# Altium schematic sheet CPU.SchDoc
size A4
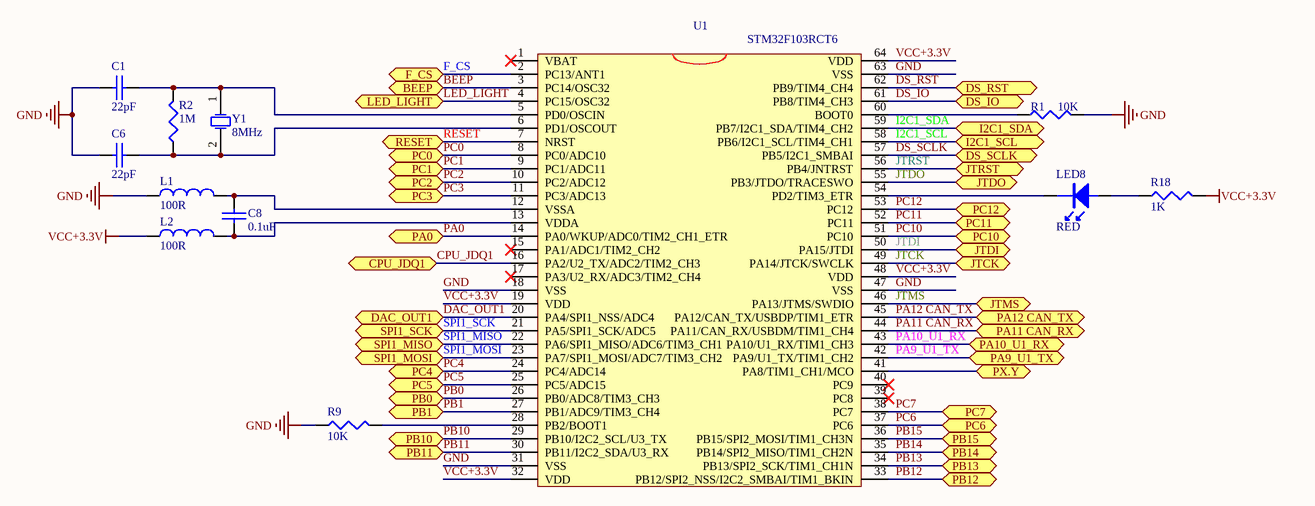
[diagram p0: CPU.SchDoc]

## Parts
C1  22pF  [0603]
C6  22pF  [0603]
C8  0.1uF  [0603]
L1  100R  [0805]
L2  100R  [0805]
LED8  RED  [LED-0603]
R1  10K  [0603]
R2  1M  [0603]
R9  10K  [0603]
R18  1K  [0603]
U1  STM32F103RCT6  [LQFP64_N]
Y1  8MHz  [XTAL_US]

## Ports
BEEP, CPU_JDQ1, DAC_OUT1, DS_IO, DS_RST, DS_SCLK, F_CS, I2C1_SCL, I2C1_SDA, JTCK, JTDI, JTDO, JTMS, JTRST, LED_LIGHT, PA0, PA9_U1_TX, PA10_U1_RX, PA11 CAN_RX, PA12 CAN_TX, PB0, PB1, PB10, PB11, PB12, PB13, PB14, PB15, PC0, PC1, PC2, PC3, PC4, PC5, PC6, PC7, PC10, PC11, PC12, PX.Y, RESET, SPI1_MISO, SPI1_MOSI, SPI1_SCK

## Nets
GND: C1.1 C6.1 L1.1 R1.2 R9.1 U1.18(VSS) U1.31(VSS) U1.47(VSS) U1.63(VSS)
VCC+3.3V: L2.1 R18.2 U1.19(VDD) U1.32(VDD) U1.48(VDD) U1.64(VDD)
BEEP: U1.3(PC14/OSC32) ; port BEEP
CPU_JDQ1: U1.16(PA2/U2_TX/ADC2/TIM2_CH3) ; port CPU_JDQ1
DAC_OUT1: U1.20(PA4/SPI1_NSS/ADC4) ; port DAC_OUT1
DS_IO: U1.61(PB8/TIM4_CH3) ; port DS_IO
DS_RST: U1.62(PB9/TIM4_CH4) ; port DS_RST
DS_SCLK: U1.57(PB5/I2C1_SMBAI) ; port DS_SCLK
F_CS: U1.2(PC13/ANT1) ; port F_CS
I2C1_SCL: U1.58(PB6/I2C1_SCL/TIM4_CH1) ; port I2C1_SCL
I2C1_SDA: U1.59(PB7/I2C1_SDA/TIM4_CH2) ; port I2C1_SDA
JTCK: U1.49(PA14/JTCK/SWCLK) ; port JTCK
JTDI: U1.50(PA15/JTDI) ; port JTDI
JTDO: U1.55(PB3/JTDO/TRACESWO) ; port JTDO
JTMS: U1.46(PA13/JTMS/SWDIO) ; port JTMS
JTRST: U1.56(PB4/JNTRST) ; port JTRST
LED_LIGHT: U1.4(PC15/OSC32) ; port LED_LIGHT
PA0: U1.14(PA0/WKUP/ADC0/TIM2_CH1_ETR) ; port PA0
PA9_U1_TX: U1.42(PA9/U1_TX/TIM1_CH2) ; port PA9_U1_TX
PA10_U1_RX: U1.43(PA10/U1_RX/TIM1_CH3) ; port PA10_U1_RX
PA11 CAN_RX: U1.44(PA11/CAN_RX/USBDM/TIM1_CH4) ; port PA11 CAN_RX
PA12 CAN_TX: U1.45(PA12/CAN_TX/USBDP/TIM1_ETR) ; port PA12 CAN_TX
PB0: U1.26(PB0/ADC8/TIM3_CH3) ; port PB0
PB1: U1.27(PB1/ADC9/TIM3_CH4) ; port PB1
PB10: U1.29(PB10/I2C2_SCL/U3_TX) ; port PB10
PB11: U1.30(PB11/I2C2_SDA/U3_RX) ; port PB11
PB12: U1.33(PB12/SPI2_NSS/I2C2_SMBAI/TIM1_BKIN) ; port PB12
PB13: U1.34(PB13/SPI2_SCK/TIM1_CH1N) ; port PB13
PB14: U1.35(PB14/SPI2_MISO/TIM1_CH2N) ; port PB14
PB15: U1.36(PB15/SPI2_MOSI/TIM1_CH3N) ; port PB15
PC0: U1.8(PC0/ADC10) ; port PC0
PC1: U1.9(PC1/ADC11) ; port PC1
PC2: U1.10(PC2/ADC12) ; port PC2
PC3: U1.11(PC3/ADC13) ; port PC3
PC4: U1.24(PC4/ADC14) ; port PC4
PC5: U1.25(PC5/ADC15) ; port PC5
PC6: U1.37(PC6) ; port PC6
PC7: U1.38(PC7) ; port PC7
PC10: U1.51(PC10) ; port PC10
PC11: U1.52(PC11) ; port PC11
PC12: U1.53(PC12) ; port PC12
PX.Y: U1.41(PA8/TIM1_CH1/MCO) ; port PX.Y
RESET: U1.7(NRST) ; port RESET
SPI1_MISO: U1.22(PA6/SPI1_MISO/ADC6/TIM3_CH1) ; port SPI1_MISO
SPI1_MOSI: U1.23(PA7/SPI1_MOSI/ADC7/TIM3_CH2) ; port SPI1_MOSI
SPI1_SCK: U1.21(PA5/SPI1_SCK/ADC5) ; port SPI1_SCK
NetC1_2: C1.2 R2.2 U1.5(PD0/OSCIN) Y1.1(OSC1)
NetC6_2: C6.2 R2.1 U1.6(PD1/OSCOUT) Y1.2(OSC2)
NetC8_1: C8.1 L2.2 U1.13(VDDA)
NetC8_2: C8.2 L1.2 U1.12(VSSA)
NetLED8_1: LED8.1 R18.1
NetLED8_2: LED8.2 U1.54(PD2/TIM3_ETR)
NetR1_1: R1.1 U1.60(BOOT0)
NetR9_2: R9.2 U1.28(PB2/BOOT1)

Not connected (* = marked no-connect by the designer): U1 1(VBAT)* 15(PA1/ADC1/TIM2_CH2)* 17(PA3/U2_RX/ADC3/TIM2_CH4)* 39(PC8)* 40(PC9)*

## Library data of the parts
C1 C6 C8 = CAP-0603: 0603陶瓷贴片电容
L1 L2 = INDUCTOR
LED8 = LED-0603: LED贴片发光二极管0603封装
R1 R2 R9 R18 = RES-0603: 陶瓷贴片电阻0603封装
U1 = STM32F103RBT6: STM32F103RCT6   LQFP64封装
Y1 = XTAL: Crystal Oscillator; Published: 8-Jun-2000; LatestRevisionDate: 17-Jul-2002; LatestRevisionNote: Re-released for DXP Platform.; Publisher: Altium Limited